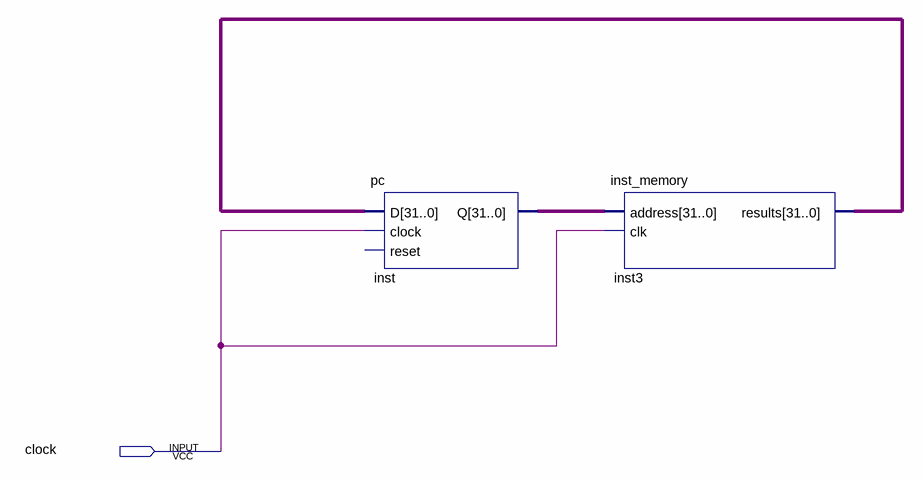
[diagram p0: schematic sheet]
// Quartus schematic oac_lab2.bdf as structural Verilog: 2 symbols, 1 pins
module oac_lab2 (
  input  clock
);

  wire [31:0] inst3_results, inst_q;

  pc inst (.D(inst3_results), .clock(clock), .Q(inst_q));  // open: reset
  inst_memory inst3 (.address(inst_q), .clk(clock), .results(inst3_results));
endmodule
